# Altium schematic sheet E17-15-IMD_SENSE.SchDoc
size A
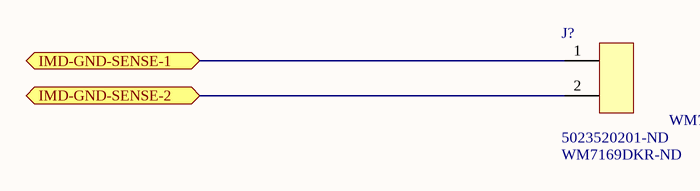
[diagram p0: E17-15-IMD_SENSE.SchDoc]

## Parts
J?  Supplier Part Number 1: 5023520201-ND  Supplier Part Number 2: WM7169DKR-ND  [MOLEX_DURACLIK_2]  (hidden comment: J_5023520200)

## Ports
IMD-GND-SENSE-1, IMD-GND-SENSE-2

## Nets
IMD-GND-SENSE-1: J?.1 ; port IMD-GND-SENSE-1
IMD-GND-SENSE-2: J?.2 ; port IMD-GND-SENSE-2

## Library data of the parts
J? = J_5023520200: MOLEX DURACLIK 2-PIN RA; Digikey_PN: WM7169CT-ND; Supplier 1: Digi-Key; Supplier 2: Digi-Key